# Altium project Flex_PCB2.PrjPcb
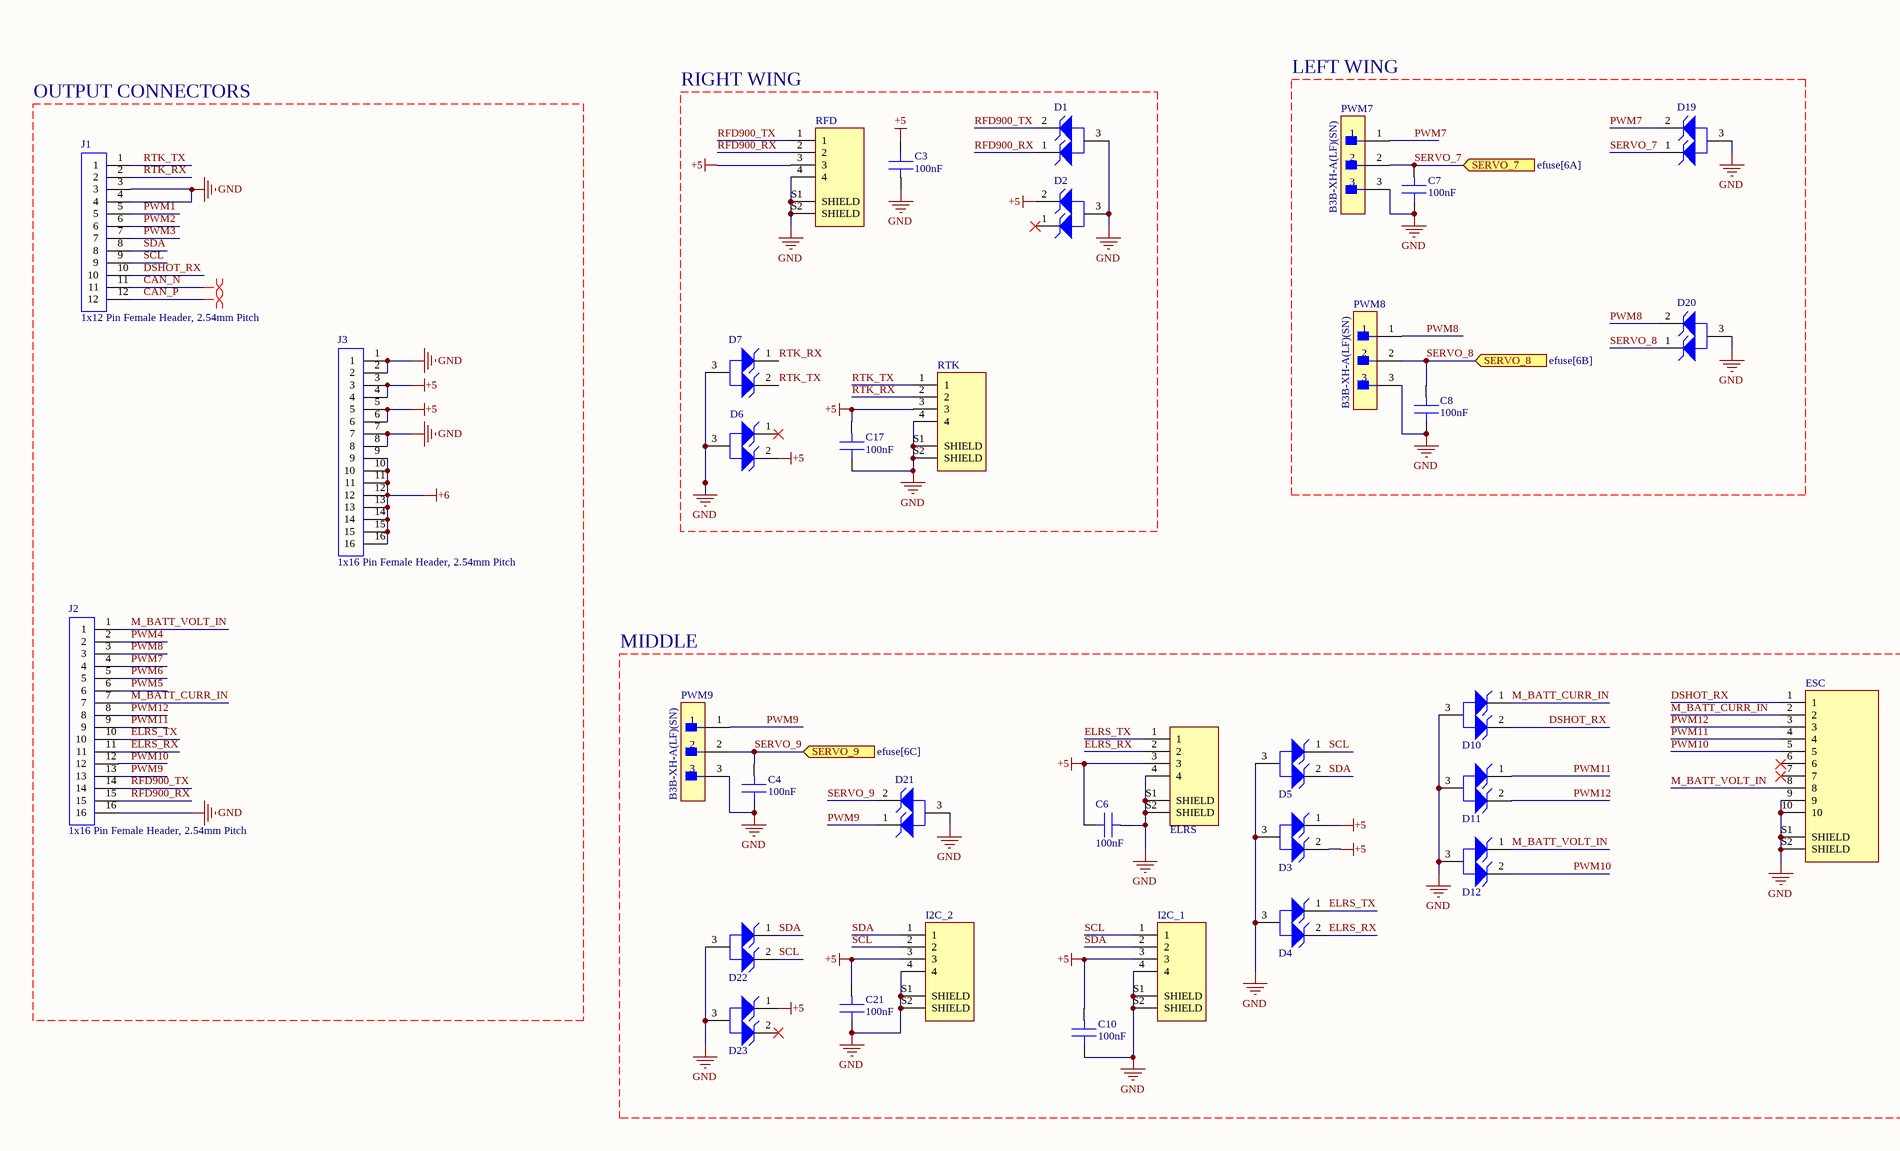
[diagram p0: Connectors_Wires.SchDoc, left]
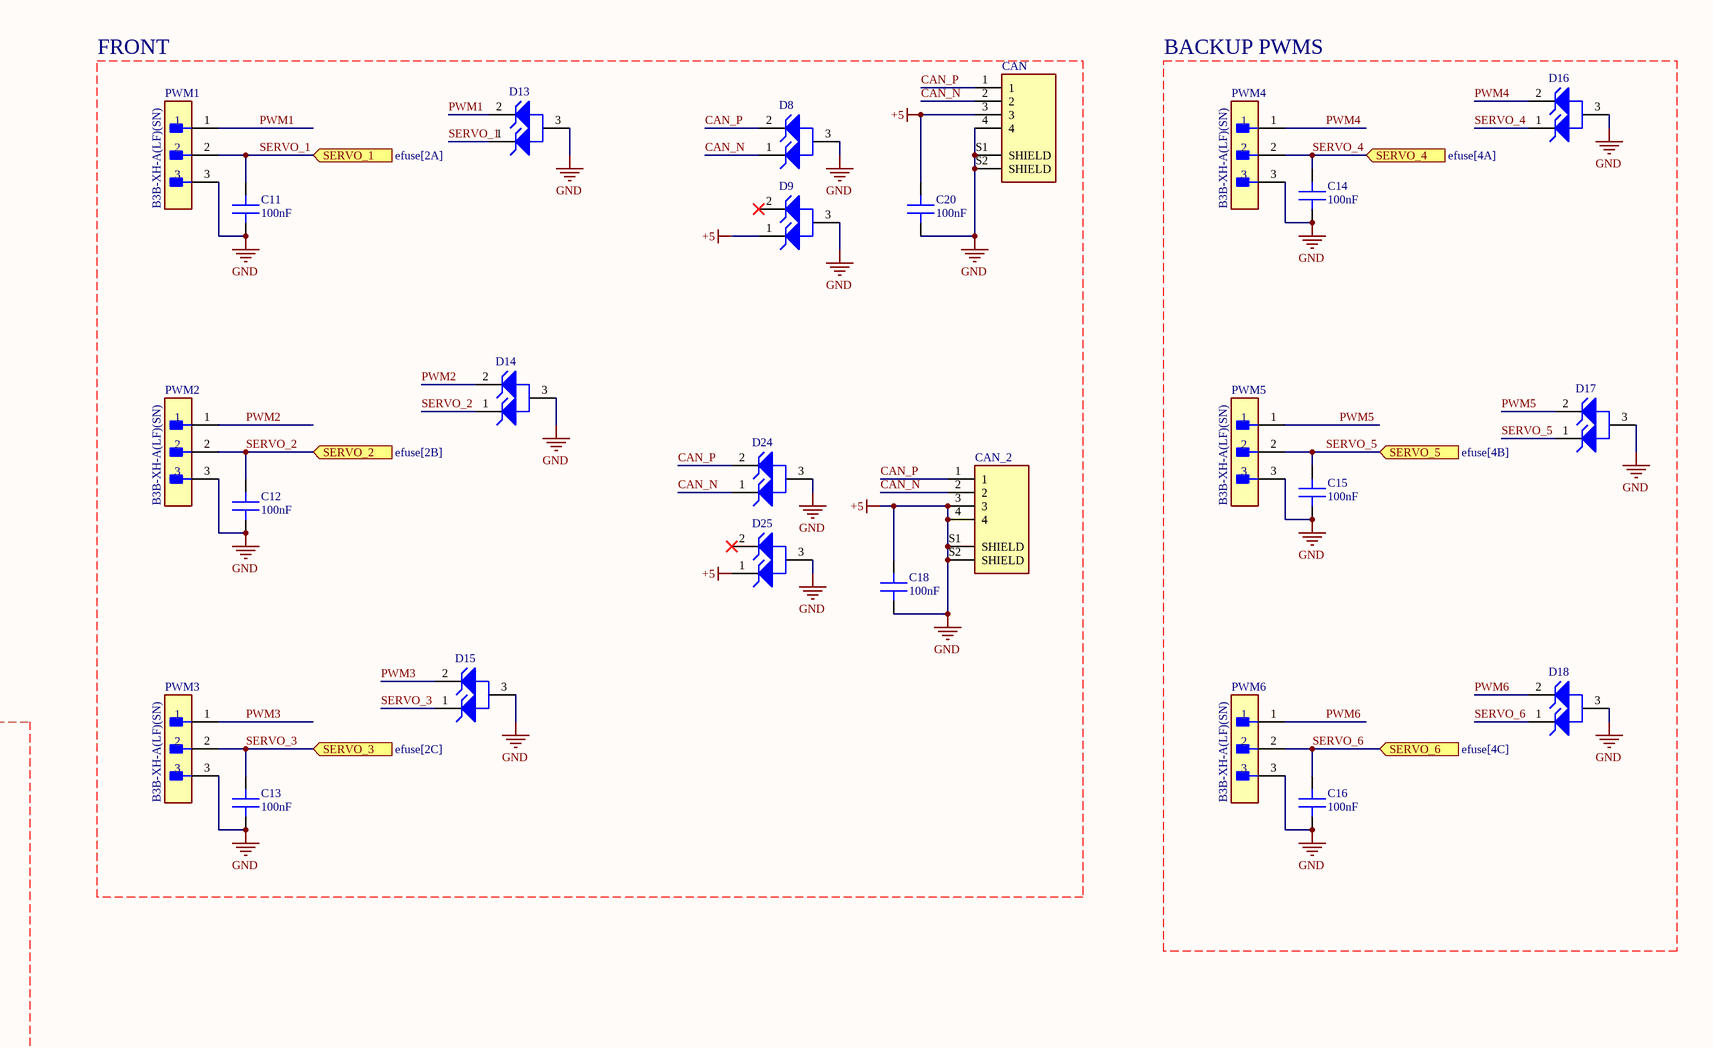
[diagram p1: Connectors_Wires.SchDoc, right]
2 sheets, 124 parts. Net scope: flat (ports and power ports of the same name join across sheets).
Board file: FlexPCB2.PcbDoc
Sheets:
  Connectors_Wires.SchDoc
  efuse.SchDoc

## Sheet Connectors_Wires.SchDoc
size 723 x 254 mm; SheetNumber: 1; SheetTotal: 2

### Parts
C3  100nF  [IPC C C0402 NO SILK]
C4  100nF  [IPC C C0402 NO SILK]
C6  100nF  [IPC C C0402 NO SILK]
C7  100nF  [IPC C C0402 NO SILK]
C8  100nF  [IPC C C0402 NO SILK]
C10  100nF  [IPC C C0402 NO SILK]
C11  100nF  [IPC C C0402 NO SILK]
C12  100nF  [IPC C C0402 NO SILK]
C13  100nF  [IPC C C0402 NO SILK]
C14  100nF  [IPC C C0402 NO SILK]
C15  100nF  [IPC C C0402 NO SILK]
C16  100nF  [IPC C C0402 NO SILK]
C17  100nF  [IPC C C0402 NO SILK]
C18  100nF  [IPC C C0402 NO SILK]
C20  100nF  [IPC C C0402 NO SILK]
C21  100nF  [IPC C C0402 NO SILK]
CAN  BM04B-GHS-TBT(LF)(SN)(N)  [JST_BM04B-GHS-TBT(LF)(SN)(N)]  (value not drawn)
CAN_2  BM04B-GHS-TBT(LF)(SN)(N)  [JST_BM04B-GHS-TBT(LF)(SN)(N)]  (value not drawn)
D1  MMBZ9V1ALT1G  [ONSC-SOT-23-3-318-08_V]  (value not drawn)
D2  MMBZ9V1ALT1G  [ONSC-SOT-23-3-318-08_V]  (value not drawn)
D3  MMBZ9V1ALT1G  [ONSC-SOT-23-3-318-08_V]  (value not drawn)
D4  MMBZ9V1ALT1G  [ONSC-SOT-23-3-318-08_V]  (value not drawn)
D5  MMBZ9V1ALT1G  [ONSC-SOT-23-3-318-08_V]  (value not drawn)
D6  MMBZ9V1ALT1G  [ONSC-SOT-23-3-318-08_V]  (value not drawn)
D7  MMBZ9V1ALT1G  [ONSC-SOT-23-3-318-08_V]  (value not drawn)
D8  MMBZ9V1ALT1G  [ONSC-SOT-23-3-318-08_V]  (value not drawn)
D9  MMBZ9V1ALT1G  [ONSC-SOT-23-3-318-08_V]  (value not drawn)
D10  MMBZ9V1ALT1G  [ONSC-SOT-23-3-318-08_V]  (value not drawn)
D11  MMBZ9V1ALT1G  [ONSC-SOT-23-3-318-08_V]  (value not drawn)
D12  MMBZ9V1ALT1G  [ONSC-SOT-23-3-318-08_V]  (value not drawn)
D13  MMBZ9V1ALT1G  [ONSC-SOT-23-3-318-08_V]  (value not drawn)
D14  MMBZ9V1ALT1G  [ONSC-SOT-23-3-318-08_V]  (value not drawn)
D15  MMBZ9V1ALT1G  [ONSC-SOT-23-3-318-08_V]  (value not drawn)
D16  MMBZ9V1ALT1G  [ONSC-SOT-23-3-318-08_V]  (value not drawn)
D17  MMBZ9V1ALT1G  [ONSC-SOT-23-3-318-08_V]  (value not drawn)
D18  MMBZ9V1ALT1G  [ONSC-SOT-23-3-318-08_V]  (value not drawn)
D19  MMBZ9V1ALT1G  [ONSC-SOT-23-3-318-08_V]  (value not drawn)
D20  MMBZ9V1ALT1G  [ONSC-SOT-23-3-318-08_V]  (value not drawn)
D21  MMBZ9V1ALT1G  [ONSC-SOT-23-3-318-08_V]  (value not drawn)
D22  MMBZ9V1ALT1G  [ONSC-SOT-23-3-318-08_V]  (value not drawn)
D23  MMBZ9V1ALT1G  [ONSC-SOT-23-3-318-08_V]  (value not drawn)
D24  MMBZ9V1ALT1G  [ONSC-SOT-23-3-318-08_V]  (value not drawn)
D25  MMBZ9V1ALT1G  [ONSC-SOT-23-3-318-08_V]  (value not drawn)
ELRS  BM04B-GHS-TBT(LF)(SN)(N)  [JST_BM04B-GHS-TBT(LF)(SN)(N)]  (value not drawn)
ESC  BM10B-GHS-TBT(LF)(SN)(N)  [JST_BM10B-GHS-TBT(LF)(SN)(N)]  (value not drawn)
I2C_1  BM04B-GHS-TBT(LF)(SN)(N)  [JST_BM04B-GHS-TBT(LF)(SN)(N)]  (value not drawn)
I2C_2  BM04B-GHS-TBT(LF)(SN)(N)  [JST_BM04B-GHS-TBT(LF)(SN)(N)]  (value not drawn)
J1  1x12 Pin Female Header, 2.54mm Pitch  [1x12 Pin Female Header, 2.54mm Pitch-Footprint-1]
J2  1x16 Pin Female Header, 2.54mm Pitch  [New footprint 1]
J3  1x16 Pin Female Header, 2.54mm Pitch  [New footprint 1]
PWM1  B3B-XH-A(LF)(SN)  [FP-B3B-XH-A_LF_SN-MFG]
PWM2  B3B-XH-A(LF)(SN)  [FP-B3B-XH-A_LF_SN-MFG]
PWM3  B3B-XH-A(LF)(SN)  [FP-B3B-XH-A_LF_SN-MFG]
PWM4  B3B-XH-A(LF)(SN)  [FP-B3B-XH-A_LF_SN-MFG]
PWM5  B3B-XH-A(LF)(SN)  [FP-B3B-XH-A_LF_SN-MFG]
PWM6  B3B-XH-A(LF)(SN)  [FP-B3B-XH-A_LF_SN-MFG]
PWM7  B3B-XH-A(LF)(SN)  [FP-B3B-XH-A_LF_SN-MFG]
PWM8  B3B-XH-A(LF)(SN)  [FP-B3B-XH-A_LF_SN-MFG]
PWM9  B3B-XH-A(LF)(SN)  [FP-B3B-XH-A_LF_SN-MFG]
RFD  BM04B-GHS-TBT(LF)(SN)(N)  [JST_BM04B-GHS-TBT(LF)(SN)(N)]  (value not drawn)
RTK  BM04B-GHS-TBT(LF)(SN)(N)  [JST_BM04B-GHS-TBT(LF)(SN)(N)]  (value not drawn)

### Ports
SERVO_1 (in, see efuse[2A]), SERVO_2 (in, see efuse[2B]), SERVO_3 (in, see efuse[2C]), SERVO_4 (in, see efuse[4A]), SERVO_5 (in, see efuse[4B]), SERVO_6 (in, see efuse[4C]), SERVO_7 (in, see efuse[6A]), SERVO_8 (in, see efuse[6B]), SERVO_9 (in, see efuse[6C])

### Nets
+5: C3.1 C3.2 C4.2 C6.1 C6.2 C7.2 C8.2 C10.1 C10.2 C11.2 C12.2 C13.2 C14.2 C15.2 C16.2 C17.1 C17.2 C18.1 C18.2 C20.1 C20.2 C21.1 C21.2 CAN.3 CAN.4 CAN.S1(SHIELD) CAN.S2(SHIELD) CAN_2.3 CAN_2.4 CAN_2.S1(SHIELD) CAN_2.S2(SHIELD) D1.3(A) D2.2(K2) D2.3(A) D3.1(K1) D3.2(K2) D3.3(A) D4.3(A) D5.3(A) D6.2(K2) D6.3(A) D7.3(A) D8.3(A) D9.1(K1) D9.3(A) D10.3(A) D11.3(A) D12.3(A) D13.3(A) D14.3(A) D15.3(A) D16.3(A) D17.3(A) D18.3(A) D19.3(A) D20.3(A) D21.3(A) D22.3(A) D23.1(K1) D23.3(A) D24.3(A) D25.1(K1) D25.3(A) ELRS.3 ELRS.4 ELRS.S1(SHIELD) ELRS.S2(SHIELD) ESC.9 ESC.10 ESC.S1(SHIELD) ESC.S2(SHIELD) I2C_1.3 I2C_1.4 I2C_1.S1(SHIELD) I2C_1.S2(SHIELD) I2C_2.3 I2C_2.4 I2C_2.S1(SHIELD) I2C_2.S2(SHIELD) J1.3 J1.4 J2.16 J3.1 J3.2 J3.3 J3.4 J3.5 J3.6 J3.7 J3.8 PWM1.3 PWM2.3 PWM3.3 PWM4.3 PWM5.3 PWM6.3 PWM7.3 PWM8.3 PWM9.3 RFD.3 RFD.4 RFD.S1(SHIELD) RFD.S2(SHIELD) RTK.3 RTK.4 RTK.S1(SHIELD) RTK.S2(SHIELD)  [also labelled GND]
+6: J3.9 J3.10 J3.11 J3.12 J3.13 J3.14 J3.15 J3.16  [project net V_OUT_SERVO]
CAN_N: CAN.2 CAN_2.2 D8.1(K1) D24.1(K1) J1.11
CAN_P: CAN.1 CAN_2.1 D8.2(K2) D24.2(K2) J1.12
DSHOT_RX: D10.2(K2) ESC.1 J1.10
ELRS_RX: D4.2(K2) ELRS.2 J2.11
ELRS_TX: D4.1(K1) ELRS.1 J2.10
M_BATT_CURR_IN: D10.1(K1) ESC.2 J2.7
M_BATT_VOLT_IN: D12.1(K1) ESC.8 J2.1
PWM1: D13.2(K2) J1.5 PWM1.1
PWM2: D14.2(K2) J1.6 PWM2.1
PWM3: D15.2(K2) J1.7 PWM3.1
PWM4: D16.2(K2) J2.2 PWM4.1
PWM5: D17.2(K2) J2.6 PWM5.1
PWM6: D18.2(K2) J2.5 PWM6.1
PWM7: D19.2(K2) J2.4 PWM7.1
PWM8: D20.2(K2) J2.3 PWM8.1
PWM9: D21.1(K1) J2.13 PWM9.1
PWM10: D12.2(K2) ESC.5 J2.12
PWM11: D11.1(K1) ESC.4 J2.9
PWM12: D11.2(K2) ESC.3 J2.8
RFD900_RX: D1.1(K1) J2.15 RFD.2
RFD900_TX: D1.2(K2) J2.14 RFD.1
RTK_RX: D7.1(K1) J1.2 RTK.2
RTK_TX: D7.2(K2) J1.1 RTK.1
SCL: D5.1(K1) D22.2(K2) I2C_1.1 I2C_2.2 J1.9
SDA: D5.2(K2) D22.1(K1) I2C_1.2 I2C_2.1 J1.8
SERVO_1: C11.1 D13.1(K1) PWM1.2 ; port SERVO_1
SERVO_2: C12.1 D14.1(K1) PWM2.2 ; port SERVO_2
SERVO_3: C13.1 D15.1(K1) PWM3.2 ; port SERVO_3
SERVO_4: C14.1 D16.1(K1) PWM4.2 ; port SERVO_4
SERVO_5: C15.1 D17.1(K1) PWM5.2 ; port SERVO_5
SERVO_6: C16.1 D18.1(K1) PWM6.2 ; port SERVO_6
SERVO_7: C7.1 D19.1(K1) PWM7.2 ; port SERVO_7
SERVO_8: C8.1 D20.1(K1) PWM8.2 ; port SERVO_8
SERVO_9: C4.1 D21.2(K2) PWM9.2 ; port SERVO_9

Not connected (* = marked no-connect by the designer): D2 1(K1)*; D6 1(K1)*; D9 2(K2)*; D23 2(K2)*; D25 2(K2)*; ESC 6* 7*

### Layout directives
differential pair: CAN_N, CAN_P

### Notes on the sheet
- RIGHT WING
- LEFT WING
- FRONT
- BACKUP PWMS
- OUTPUT CONNECTORS
- MIDDLE

### Library data of the parts
C3 C4 C6-C8 C10-C18 C20 C21 = CMP-002-000000-1: Value: 100nF; Source: Schlib1.SchLib; Design Item ID: Generic CAP 0402
CAN CAN_2 ELRS I2C_1 I2C_2 RFD RTK = CMP-003-000009-3: Conn Shrouded Header HDR 4 POS 1.25mm Solder ST Top Entry SMD T/R; MF: JST; Package: None; Check_prices: https://www.snapeda.com/parts/BM04B-GHS-TBT%20(LF)(SN)(N)/JST/view-part/?ref=eda; MP: BM04B-GHS-TBT (LF)(SN)(N); Source: BM04B-GHS-TBT(LF)(SN)(N).SchLib; Design Item ID: BM04B-GHS-TBT(LF)(SN)(N); Value: *; Component Type: Standard; SnapEDA_Link: https://www.snapeda.com/parts/BM04B-GHS-TBT%20(LF)(SN)(N)/JST/view-part/?ref=snap; Pin Count: 6
D1-D25 = CMP-1060-01253-1: 24 W Peak Power Zener Transient Voltage Suppressor, Dual Common Anode Zeners for ESD Protection, 3-Pin SOT-23, Pb-Free, Tape and Reel; Manufacturer: On Semiconductor; VZ Typ (V): 9.1; ComponentLink1URL: http://www.onsemi.com/; ComponentLink2URL: http://www.onsemi.cn/pub_link/Collateral/MMBZ5V6ALT1-D.PDF; ComponentLink1Description: Manufacturer URL; PackageDescription: 3-Pin Small Outline Transistor, Body 2.92 x 1.3 mm, Pitch 0.95 mm; DatasheetVersion: Rev. 13; PartNumber: MMBZ9V1ALT1G; ComponentLink3URL: http://www.onsemi.cn/pub_link/Collateral/318-08.PDF; Mounting Technology: Surface Mount; Packing: Tape and Reel; PackageVersion: Rev. AP, 11/2009; PackageReference: SOT-23-3-318-08; RoHS: Pb-Free; ComponentLink3Description: Package Specification; ComponentLink2Description: Datasheet
ESC = CMP-003-000010-2: Connector Header Surface Mount 10 position 0.049 (1.25mm); MF: JST Sales; Value: *; MP: BM10B-GHS-TBT(LF)(SN)(N); Price: None; Package: None; Design Item ID: BM10B-GHS-TBT(LF)(SN)(N); Component Type: Standard; Purchase-URL: https://pricing.snapeda.com/search/part/BM10B-GHS-TBT(LF)(SN)(N)/?ref=eda; Source: BM10B-GHS-TBT(LF)(SN)(N).SchLib; Pin Count: 12; Check_prices: https://www.snapeda.com/parts/BM10B-GHS-TBT(LF)(SN)(N)/JST+Sales+America+Inc./view-part/?ref=eda; SnapEDA_Link: https://www.snapeda.com/parts/BM10B-GHS-TBT(LF)(SN)(N)/JST+Sales+America+Inc./view-part/?ref=snap; Availability: In Stock
J1 = CMP-003-000007-1
J2 J3 = CMP-00039-2
PWM1-PWM9 = CMP-17439-000014-3: CONN HEADER VERT 3POS 2.5MM; Max Voltage Rating (DC): 250V; Number of Positions: 3; Current Rating: 3A; Gender: Male; Wire/Cable Gauge: 22AWG; Contact Resistance: 20mR; Insulation Resistance: 1GR; Insulation Material: Nylon; Contact Plating: Tin; Depth: 5.75mm; Contact Type: Male Pin; Max Operating Temperature: 85°C; Insulation Color: Natural; Voltage Rating (AC): 250V; Color: Natural; Connector Type: Header; Orientation: Straight; Fastening Type: Detent; Housing Color: White; Min Operating Temperature: -25°C; Termination: Solder; Voltage Rating: 250V; Series: XH; Pitch: 2.5mm; Contact Shape: Square; Number of Rows: 1; Lead Free: Lead Free; Packaging: Bulk; Mount: Through Hole; Flammability Rating: UL94 V-0; Max Voltage Rating (AC): 250V; REACH SVHC: No SVHC; Housing Material: Polyamide; Contact Material: Brass; Lead Pitch: 2.5mm; Contact Finish - Mating: TIN; Length: 9.9mm; Max Current Rating: 3A; Number of Contacts: 3

## Sheet efuse.SchDoc
size 482 x 208 mm; SheetNumber: 1; SheetTotal: 2
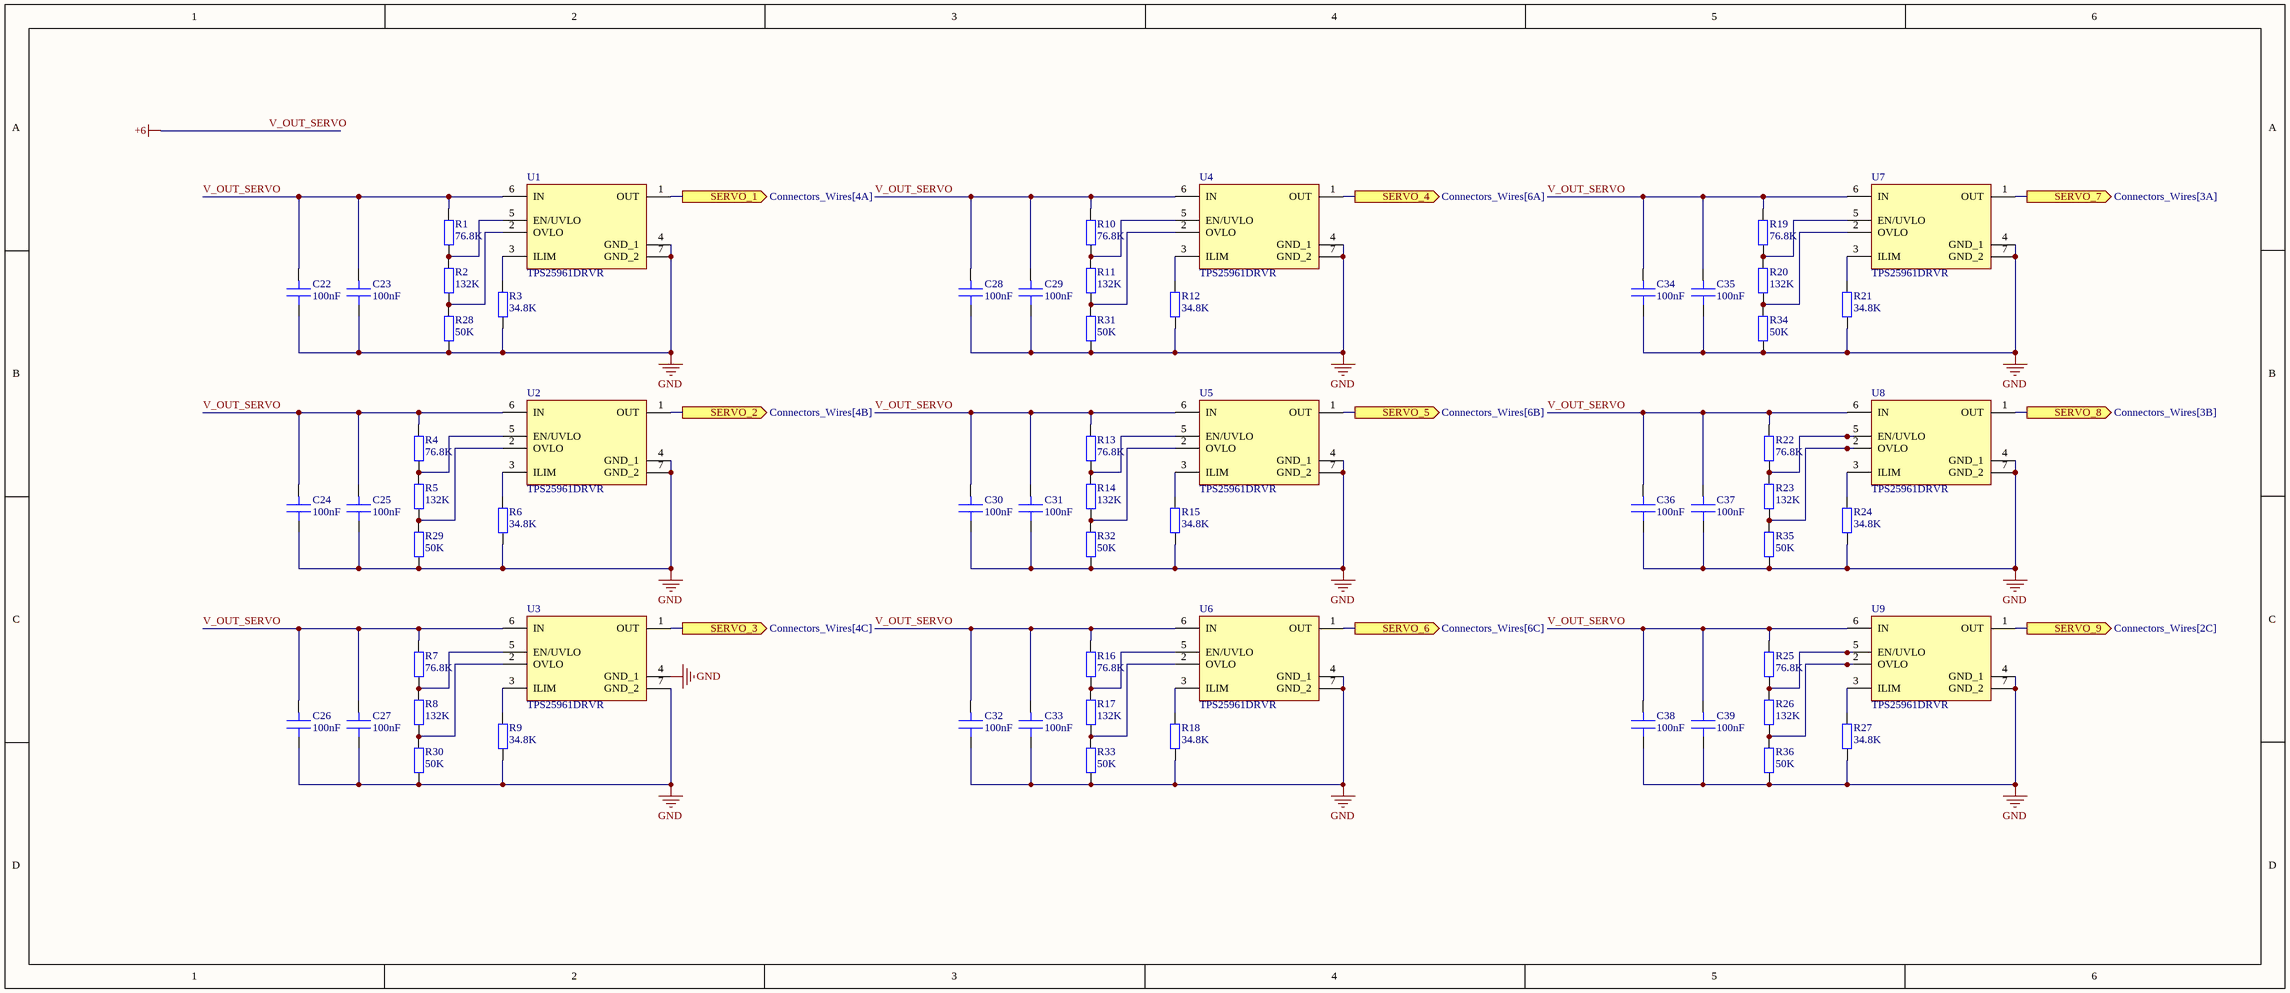
[diagram p2: efuse.SchDoc]

### Parts
C22  100nF  [IPC C C0402 NO SILK]
C23  100nF  [IPC C C0402 NO SILK]
C24  100nF  [IPC C C0402 NO SILK]
C25  100nF  [IPC C C0402 NO SILK]
C26  100nF  [IPC C C0402 NO SILK]
C27  100nF  [IPC C C0402 NO SILK]
C28  100nF  [IPC C C0402 NO SILK]
C29  100nF  [IPC C C0402 NO SILK]
C30  100nF  [IPC C C0402 NO SILK]
C31  100nF  [IPC C C0402 NO SILK]
C32  100nF  [IPC C C0402 NO SILK]
C33  100nF  [IPC C C0402 NO SILK]
C34  100nF  [IPC C C0402 NO SILK]
C35  100nF  [IPC C C0402 NO SILK]
C36  100nF  [IPC C C0402 NO SILK]
C37  100nF  [IPC C C0402 NO SILK]
C38  100nF  [IPC C C0402 NO SILK]
C39  100nF  [IPC C C0402 NO SILK]
R1  76.8K  [IPC C R0402 NO SILK]
R2  132K  [IPC C R0402 NO SILK]
R3  34.8K  [IPC C R0402 NO SILK]
R4  76.8K  [IPC C R0402 NO SILK]
R5  132K  [IPC C R0402 NO SILK]
R6  34.8K  [IPC C R0402 NO SILK]
R7  76.8K  [IPC C R0402 NO SILK]
R8  132K  [IPC C R0402 NO SILK]
R9  34.8K  [IPC C R0402 NO SILK]
R10  76.8K  [IPC C R0402 NO SILK]
R11  132K  [IPC C R0402 NO SILK]
R12  34.8K  [IPC C R0402 NO SILK]
R13  76.8K  [IPC C R0402 NO SILK]
R14  132K  [IPC C R0402 NO SILK]
R15  34.8K  [IPC C R0402 NO SILK]
R16  76.8K  [IPC C R0402 NO SILK]
R17  132K  [IPC C R0402 NO SILK]
R18  34.8K  [IPC C R0402 NO SILK]
R19  76.8K  [IPC C R0402 NO SILK]
R20  132K  [IPC C R0402 NO SILK]
R21  34.8K  [IPC C R0402 NO SILK]
R22  76.8K  [IPC C R0402 NO SILK]
R23  132K  [IPC C R0402 NO SILK]
R24  34.8K  [IPC C R0402 NO SILK]
R25  76.8K  [IPC C R0402 NO SILK]
R26  132K  [IPC C R0402 NO SILK]
R27  34.8K  [IPC C R0402 NO SILK]
R28  50K  [IPC C R0402 NO SILK]
R29  50K  [IPC C R0402 NO SILK]
R30  50K  [IPC C R0402 NO SILK]
R31  50K  [IPC C R0402 NO SILK]
R32  50K  [IPC C R0402 NO SILK]
R33  50K  [IPC C R0402 NO SILK]
R34  50K  [IPC C R0402 NO SILK]
R35  50K  [IPC C R0402 NO SILK]
R36  50K  [IPC C R0402 NO SILK]
U1  TPS25961DRVR  [TPS25961DRVR-Footprint-1]
U2  TPS25961DRVR  [TPS25961DRVR-Footprint-1]
U3  TPS25961DRVR  [TPS25961DRVR-Footprint-1]
U4  TPS25961DRVR  [TPS25961DRVR-Footprint-1]
U5  TPS25961DRVR  [TPS25961DRVR-Footprint-1]
U6  TPS25961DRVR  [TPS25961DRVR-Footprint-1]
U7  TPS25961DRVR  [TPS25961DRVR-Footprint-1]
U8  TPS25961DRVR  [TPS25961DRVR-Footprint-1]
U9  TPS25961DRVR  [TPS25961DRVR-Footprint-1]

### Ports
SERVO_1 (out, see Connectors_Wires[4A]), SERVO_2 (out, see Connectors_Wires[4B]), SERVO_3 (out, see Connectors_Wires[4C]), SERVO_4 (out, see Connectors_Wires[6A]), SERVO_5 (out, see Connectors_Wires[6B]), SERVO_6 (out, see Connectors_Wires[6C]), SERVO_7 (out, see Connectors_Wires[3A]), SERVO_8 (out, see Connectors_Wires[3B]), SERVO_9 (out, see Connectors_Wires[2C])

### Nets
GND: C22.2 C23.2 C24.2 C25.2 C26.2 C27.2 C28.2 C29.2 C30.2 C31.2 C32.2 C33.2 C34.2 C35.2 C36.2 C37.2 C38.2 C39.2 R3.1 R6.1 R9.1 R12.1 R15.1 R18.1 R21.1 R24.1 R27.1 R28.1 R29.1 R30.1 R31.1 R32.1 R33.1 R34.1 R35.1 R36.1 U1.4(GND_1) U1.7(GND_2) U2.4(GND_1) U2.7(GND_2) U3.4(GND_1) U3.7(GND_2) U4.4(GND_1) U4.7(GND_2) U5.4(GND_1) U5.7(GND_2) U6.4(GND_1) U6.7(GND_2) U7.4(GND_1) U7.7(GND_2) U8.4(GND_1) U8.7(GND_2) U9.4(GND_1) U9.7(GND_2)  [project net +5]
V_OUT_SERVO: C22.1 C23.1 C24.1 C25.1 C26.1 C27.1 C28.1 C29.1 C30.1 C31.1 C32.1 C33.1 C34.1 C35.1 C36.1 C37.1 C38.1 C39.1 R1.2 R4.2 R7.2 R10.2 R13.2 R16.2 R19.2 R22.2 R25.2 U1.6(IN) U2.6(IN) U3.6(IN) U4.6(IN) U5.6(IN) U6.6(IN) U7.6(IN) U8.6(IN) U9.6(IN)  [also labelled +6]
SERVO_1: U1.1(OUT) ; port SERVO_1
SERVO_2: U2.1(OUT) ; port SERVO_2
SERVO_3: U3.1(OUT) ; port SERVO_3
SERVO_4: U4.1(OUT) ; port SERVO_4
SERVO_5: U5.1(OUT) ; port SERVO_5
SERVO_6: U6.1(OUT) ; port SERVO_6
SERVO_7: U7.1(OUT) ; port SERVO_7
SERVO_8: U8.1(OUT) ; port SERVO_8
SERVO_9: U9.1(OUT) ; port SERVO_9
NetR1_1: R1.1 R2.2 U1.5(EN/UVLO)
NetR2_1: R2.1 R28.2 U1.2(OVLO)
NetR3_2: R3.2 U1.3(ILIM)
NetR4_1: R4.1 R5.2 U2.5(EN/UVLO)
NetR5_1: R5.1 R29.2 U2.2(OVLO)
NetR6_2: R6.2 U2.3(ILIM)
NetR7_1: R7.1 R8.2 U3.5(EN/UVLO)
NetR8_1: R8.1 R30.2 U3.2(OVLO)
NetR9_2: R9.2 U3.3(ILIM)
NetR10_1: R10.1 R11.2 U4.5(EN/UVLO)
NetR11_1: R11.1 R31.2 U4.2(OVLO)
NetR12_2: R12.2 U4.3(ILIM)
NetR13_1: R13.1 R14.2 U5.5(EN/UVLO)
NetR14_1: R14.1 R32.2 U5.2(OVLO)
NetR15_2: R15.2 U5.3(ILIM)
NetR16_1: R16.1 R17.2 U6.5(EN/UVLO)
NetR17_1: R17.1 R33.2 U6.2(OVLO)
NetR18_2: R18.2 U6.3(ILIM)
NetR19_1: R19.1 R20.2 U7.5(EN/UVLO)
NetR20_1: R20.1 R34.2 U7.2(OVLO)
NetR21_2: R21.2 U7.3(ILIM)
NetR22_1: R22.1 R23.2 U8.5(EN/UVLO)
NetR23_1: R23.1 R35.2 U8.2(OVLO)
NetR24_2: R24.2 U8.3(ILIM)
NetR25_1: R25.1 R26.2 U9.5(EN/UVLO)
NetR26_1: R26.1 R36.2 U9.2(OVLO)
NetR27_2: R27.2 U9.3(ILIM)

### Library data of the parts
C22-C39 = CMP-002-000000-2: Input capacitor; Value: 100nF; Design Item ID: Generic CAP 0402; Source: Schlib1.SchLib
R1-R36 = CMP-008-000000-2: Generic RES 0402; Source: Schlib1.SchLib; Design Item ID: Generic RES 0402
  R1 R4 R7 R10 R13 R16 R19 R22 R25: Value: 76.8K
  R2 R5 R8 R11 R14 R17 R20 R23 R26: Value: 132K
  R3 R6 R9 R12 R15 R18 R21 R24 R27: Value: 34.8K
  R28-R36: Value: 50K
U1-U9 = CMP-00038-2: 2.7-V TO 19-V 100-M EFUSE WITH O Hot Swap Controller 1 Channel General Purpose 6-WSON (2x2); Manufacturer Lifecycle Status: ACTIVE; Thickness: 750µm; Height: 800µm; RoHS: Compliant; Lifecycle Status: Production; Length: 2mm; Width: 2mm; Pins: 6

## Nets that join several sheets
+5: Connectors_Wires (107 pins), efuse (54 pins)
V_OUT_SERVO: Connectors_Wires (8 pins), efuse (36 pins)
SERVO_1: Connectors_Wires (C11.1 D13.1 PWM1.2), efuse (U1.1)
SERVO_2: Connectors_Wires (C12.1 D14.1 PWM2.2), efuse (U2.1)
SERVO_3: Connectors_Wires (C13.1 D15.1 PWM3.2), efuse (U3.1)
SERVO_4: Connectors_Wires (C14.1 D16.1 PWM4.2), efuse (U4.1)
SERVO_5: Connectors_Wires (C15.1 D17.1 PWM5.2), efuse (U5.1)
SERVO_6: Connectors_Wires (C16.1 D18.1 PWM6.2), efuse (U6.1)
SERVO_7: Connectors_Wires (C7.1 D19.1 PWM7.2), efuse (U7.1)
SERVO_8: Connectors_Wires (C8.1 D20.1 PWM8.2), efuse (U8.1)
SERVO_9: Connectors_Wires (C4.1 D21.2 PWM9.2), efuse (U9.1)